# EAGLE design shifter (EAGLE 6.4)
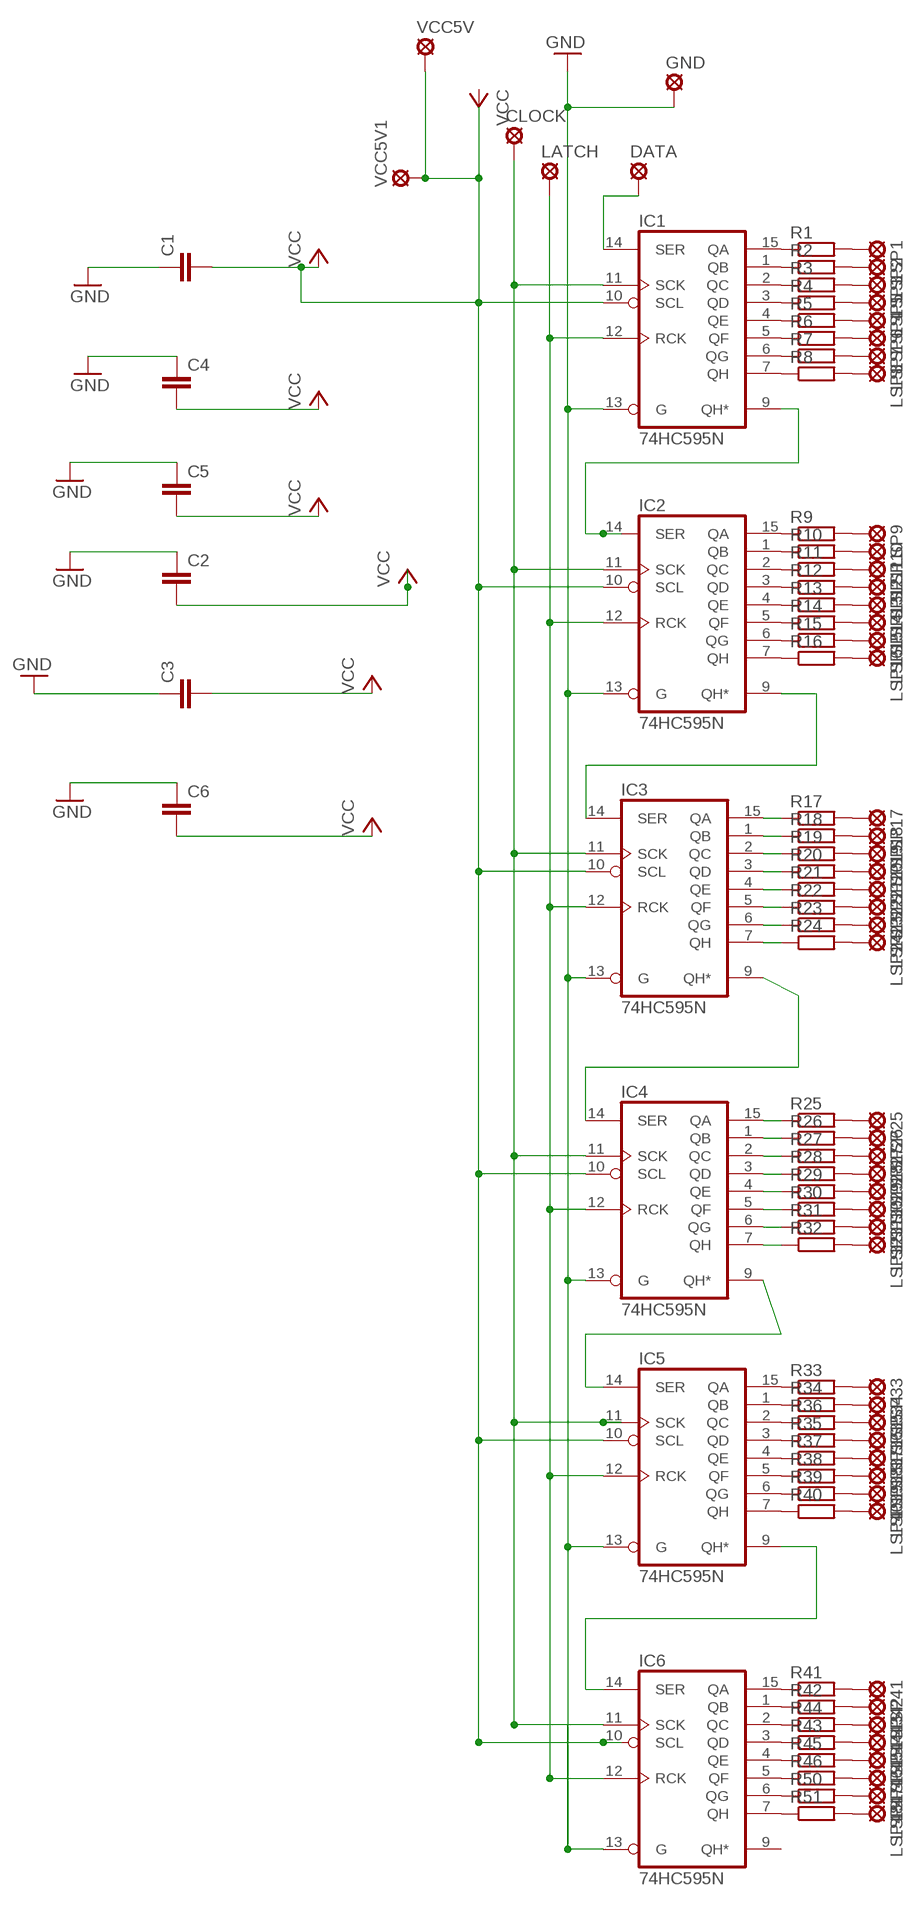
[diagram p0: schematic, sheet 1]

## Parts
C1  C-EU025-025X050  [C025-025X050]
C2  C-EU025-025X050  [C025-025X050]
C3  C-EU025-025X050  [C025-025X050]
C4  C-EU025-025X050  [C025-025X050]
C5  C-EU025-025X050  [C025-025X050]
C6  C-EU025-025X050  [C025-025X050]
CLOCK  LSP10  [LSP10]
DATA  LSP10  [LSP10]
GND  LSP10  [LSP10]
IC1  74HC595N  [DIL16]
IC2  74HC595N  [DIL16]
IC3  74HC595N  [DIL16]
IC4  74HC595N  [DIL16]
IC5  74HC595N  [DIL16]
IC6  74HC595N  [DIL16]
LATCH  LSP10  [LSP10]
LSP1  LSP10  [LSP10]
LSP2  LSP10  [LSP10]
LSP3  LSP10  [LSP10]
LSP4  LSP10  [LSP10]
LSP5  LSP10  [LSP10]
LSP6  LSP10  [LSP10]
LSP7  LSP10  [LSP10]
LSP8  LSP10  [LSP10]
LSP9  LSP10  [LSP10]
LSP10  LSP10  [LSP10]
LSP11  LSP10  [LSP10]
LSP12  LSP10  [LSP10]
LSP13  LSP10  [LSP10]
LSP14  LSP10  [LSP10]
LSP15  LSP10  [LSP10]
LSP16  LSP10  [LSP10]
LSP17  LSP10  [LSP10]
LSP18  LSP10  [LSP10]
LSP19  LSP10  [LSP10]
LSP20  LSP10  [LSP10]
LSP21  LSP10  [LSP10]
LSP22  LSP10  [LSP10]
LSP23  LSP10  [LSP10]
LSP24  LSP10  [LSP10]
LSP25  LSP10  [LSP10]
LSP26  LSP10  [LSP10]
LSP27  LSP10  [LSP10]
LSP28  LSP10  [LSP10]
LSP29  LSP10  [LSP10]
LSP30  LSP10  [LSP10]
LSP31  LSP10  [LSP10]
LSP32  LSP10  [LSP10]
LSP33  LSP10  [LSP10]
LSP34  LSP10  [LSP10]
LSP35  LSP10  [LSP10]
LSP36  LSP10  [LSP10]
LSP37  LSP10  [LSP10]
LSP38  LSP10  [LSP10]
LSP39  LSP10  [LSP10]
LSP40  LSP10  [LSP10]
LSP41  LSP10  [LSP10]
LSP42  LSP10  [LSP10]
LSP43  LSP10  [LSP10]
LSP44  LSP10  [LSP10]
LSP45  LSP10  [LSP10]
LSP46  LSP10  [LSP10]
LSP47  LSP10  [LSP10]
LSP48  LSP10  [LSP10]
R1  R-EU_0204/2V  [0204V]
R2  R-EU_0204/2V  [0204V]
R3  R-EU_0204/2V  [0204V]
R4  R-EU_0204/2V  [0204V]
R5  R-EU_0204/2V  [0204V]
R6  R-EU_0204/2V  [0204V]
R7  R-EU_0204/2V  [0204V]
R8  R-EU_0204/2V  [0204V]
R9  R-EU_0204/2V  [0204V]
R10  R-EU_0204/2V  [0204V]
R11  R-EU_0204/2V  [0204V]
R12  R-EU_0204/2V  [0204V]
R13  R-EU_0204/2V  [0204V]
R14  R-EU_0204/2V  [0204V]
R15  R-EU_0204/2V  [0204V]
R16  R-EU_0204/2V  [0204V]
R17  R-EU_0204/2V  [0204V]
R18  R-EU_0204/2V  [0204V]
R19  R-EU_0204/2V  [0204V]
R20  R-EU_0204/2V  [0204V]
R21  R-EU_0204/2V  [0204V]
R22  R-EU_0204/2V  [0204V]
R23  R-EU_0204/2V  [0204V]
R24  R-EU_0204/2V  [0204V]
R25  R-EU_0204/2V  [0204V]
R26  R-EU_0204/2V  [0204V]
R27  R-EU_0204/2V  [0204V]
R28  R-EU_0204/2V  [0204V]
R29  R-EU_0204/2V  [0204V]
R30  R-EU_0204/2V  [0204V]
R31  R-EU_0204/2V  [0204V]
R32  R-EU_0204/2V  [0204V]
R33  R-EU_0204/2V  [0204V]
R34  R-EU_0204/2V  [0204V]
R35  R-EU_0204/2V  [0204V]
R36  R-EU_0204/2V  [0204V]
R37  R-EU_0204/2V  [0204V]
R38  R-EU_0204/2V  [0204V]
R39  R-EU_0204/2V  [0204V]
R40  R-EU_0204/2V  [0204V]
R41  R-EU_0204/2V  [0204V]
R42  R-EU_0204/2V  [0204V]
R43  R-EU_0204/2V  [0204V]
R44  R-EU_0204/2V  [0204V]
R45  R-EU_0204/2V  [0204V]
R46  R-EU_0204/2V  [0204V]
R50  R-EU_0204/2V  [0204V]
R51  R-EU_0204/2V  [0204V]
VCC5V  LSP10  [LSP10]
VCC5V1  LSP10  [LSP10]

## Nets
N$1: IC6.2(QC) R44.1
N$2: IC6.3(QD) R43.1
N$3: LSP1.MP R1.2
N$4: IC1.9(QH*) IC2.14(SER)
N$5: IC2.9(QH*) IC3.14(SER)
N$6: LSP17.MP R17.2
N$7: IC4.9(QH*) IC5.14(SER)
N$8: LSP25.MP R25.2
N$9: C1.1 C2.1 C3.1 C4.1 C5.1 C6.1 GND.MP IC1.13(G) IC2.13(G) IC3.13(G) IC4.13(G) IC5.13(G) IC6.13(G) ; supply symbol labelled GND
N$10: IC1.15(QA) R1.1
N$11: LSP41.MP R41.2
N$12: IC1.1(QB) R2.1
N$13: IC1.2(QC) R3.1
N$14: IC1.3(QD) R4.1
N$15: IC1.4(QE) R5.1
N$16: IC1.5(QF) R6.1
N$17: IC1.6(QG) R7.1
N$18: IC1.7(QH) R8.1
N$19: IC2.15(QA) R9.1
N$20: IC2.1(QB) R10.1
N$21: IC2.2(QC) R11.1
N$22: IC2.3(QD) R12.1
N$23: IC2.4(QE) R13.1
N$24: IC2.5(QF) R14.1
N$25: IC2.6(QG) R15.1
N$26: IC2.7(QH) R16.1
N$27: IC3.15(QA) R17.1
N$28: IC3.1(QB) R18.1
N$29: IC3.2(QC) R19.1
N$30: IC3.3(QD) R20.1
N$31: IC3.4(QE) R21.1
N$32: IC3.5(QF) R22.1
N$33: IC3.6(QG) R23.1
N$34: IC3.7(QH) R24.1
N$35: IC4.15(QA) R25.1
N$36: IC4.1(QB) R26.1
N$37: IC4.2(QC) R27.1
N$38: IC4.3(QD) R28.1
N$39: IC4.4(QE) R29.1
N$40: IC4.5(QF) R30.1
N$41: IC4.6(QG) R31.1
N$42: IC4.7(QH) R32.1
N$43: IC5.15(QA) R33.1
N$44: IC5.1(QB) R34.1
N$45: IC5.2(QC) R36.1
N$46: IC5.3(QD) R35.1
N$47: IC5.4(QE) R37.1
N$48: IC5.5(QF) R38.1
N$49: IC5.6(QG) R39.1
N$50: IC5.7(QH) R40.1
N$51: IC6.15(QA) R41.1
N$52: IC6.1(QB) R42.1
N$53: IC6.4(QE) R45.1
N$54: IC6.5(QF) R46.1
N$55: IC6.6(QG) R50.1
N$56: IC6.7(QH) R51.1
N$57: LSP2.MP R2.2
N$58: LSP3.MP R3.2
N$59: LSP4.MP R5.2
N$60: LSP5.MP R4.2
N$61: LSP6.MP R6.2
N$62: LSP7.MP R7.2
N$63: LSP8.MP R8.2
N$64: LSP9.MP R9.2
N$65: LSP10.MP R10.2
N$66: LSP12.MP R12.2
N$67: LSP13.MP R13.2
N$68: LSP14.MP R14.2
N$69: LSP15.MP R15.2
N$70: LSP11.MP R11.2
N$71: LSP16.MP R16.2
N$72: LSP18.MP R18.2
N$73: LSP19.MP R19.2
N$74: LSP20.MP R20.2
N$75: LSP21.MP R21.2
N$76: LSP23.MP R23.2
N$77: LSP24.MP R24.2
N$78: LSP22.MP R22.2
N$79: LSP26.MP R26.2
N$80: LSP27.MP R27.2
N$81: LSP28.MP R28.2
N$82: LSP29.MP R29.2
N$83: LSP30.MP R30.2
N$84: LSP31.MP R31.2
N$85: LSP32.MP R32.2
N$86: LSP33.MP R33.2
N$87: LSP34.MP R34.2
N$88: LSP35.MP R36.2
N$89: LSP36.MP R35.2
N$90: LSP37.MP R37.2
N$91: LSP38.MP R38.2
N$92: LSP39.MP R39.2
N$93: LSP40.MP R40.2
N$94: LSP42.MP R42.2
N$95: LSP44.MP R43.2
N$96: LSP46.MP R46.2
N$97: LSP47.MP R50.2
N$98: LSP48.MP R51.2
N$99: LSP43.MP R44.2
N$100: LSP45.MP R45.2
N$101: IC3.9(QH*) IC4.14(SER)
N$102: CLOCK.MP IC1.11(SCK) IC2.11(SCK) IC3.11(SCK) IC4.11(SCK) IC5.11(SCK) IC6.11(SCK)
N$103: DATA.MP IC1.14(SER)
N$110: IC1.12(RCK) IC2.12(RCK) IC3.12(RCK) IC4.12(RCK) IC5.12(RCK) IC6.12(RCK) LATCH.MP
N$129: IC5.9(QH*) IC6.14(SER)
VCC: C1.2 C2.2 C3.2 C4.2 C5.2 C6.2 IC1.10(SCL) IC2.10(SCL) IC3.10(SCL) IC4.10(SCL) IC5.10(SCL) IC6.10(SCL) VCC5V1.MP VCC5V.MP
Unconnected: IC6.9(QH*)

## Power pins joined to a net without a drawn wire
N$9: IC1.8(GND) IC2.8(GND) IC3.8(GND) IC4.8(GND) IC5.8(GND) IC6.8(GND)
VCC: IC1.16(VCC) IC2.16(VCC) IC3.16(VCC) IC4.16(VCC) IC5.16(VCC) IC6.16(VCC)

## Library data of the parts
C1-C6 = resistor:C-EU: CAPACITOR, European symbol
CLOCK DATA GND LATCH LSP1-LSP48 VCC5V VCC5V1 = solpad:LSP10: SOLDER PAD drill 1.0 mm, distributor Buerklin, 12H555
IC1-IC6 = 74xx-eu:74*595: 8-bit SHIFT REGISTER, output latch
R1-R46 R50 R51 = rcl:R-EU_: RESISTOR, European symbol

## Board
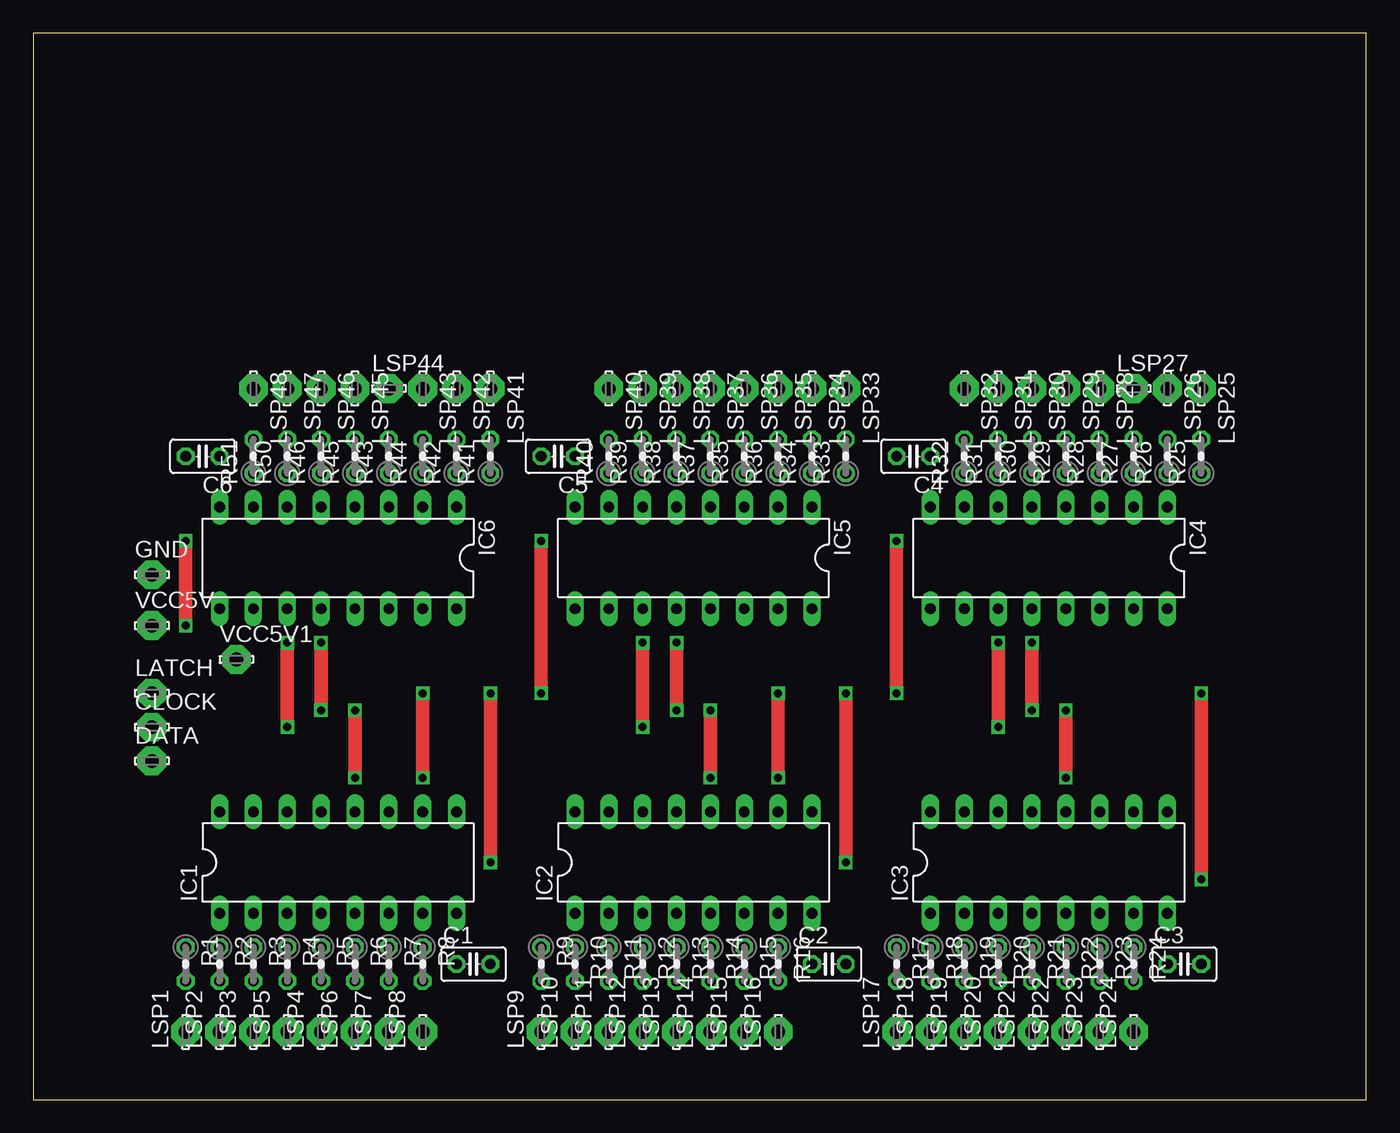
[diagram p1: board, top side]
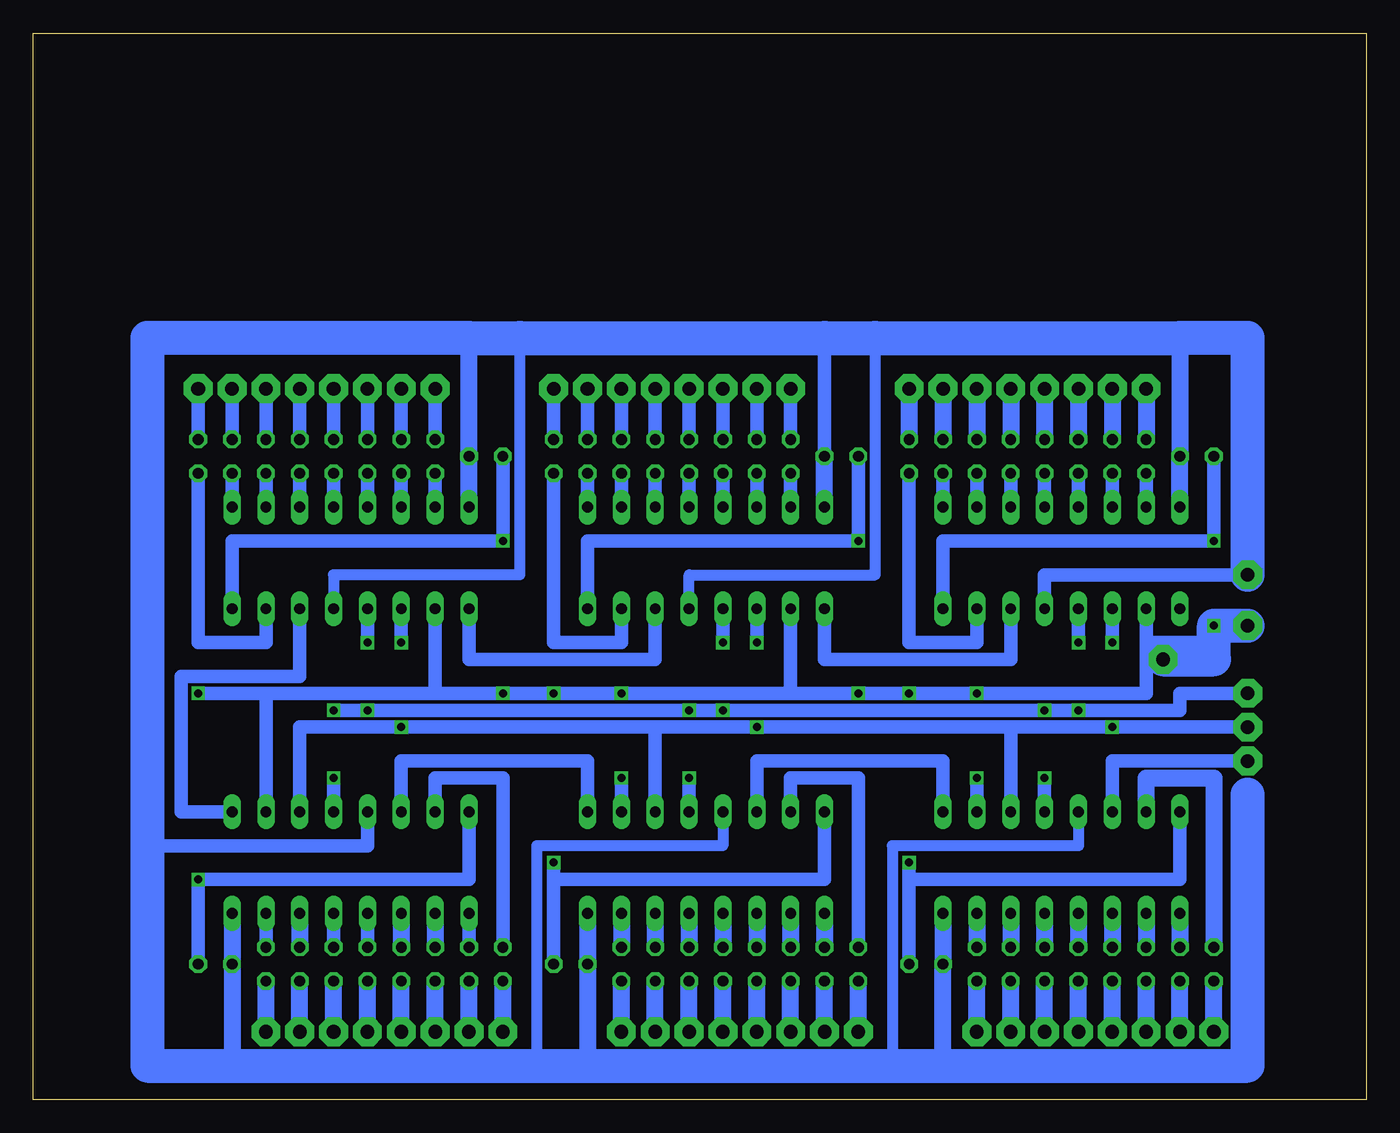
[diagram p2: board, bottom side, seen from below]

Size 100 x 80 mm. Coordinates in mm from the lower left corner, seen from the top.
Outline: 0,0 100,0 100,80 0,80 0,0
Copper layers (1*16): Top 0.035mm / dielectric 1.5mm / Bottom 0.035mm
Design rules "default": minimum track width 10mil, minimum drill 24mil, track to track 8mil, track to pad 8mil, pad to pad 8mil, via to via 8mil, smd to smd 8mil, copper to edge 40mil, drill to drill 8mil, minimum pad ring 10mil, minimum via ring 8mil, stop-mask expansion 4mil, vias tented up to drill 0mil, thermal gap 10mil

### Footprints (pad centres in the part's own frame; a part is rotated, then mirrored left to right if it is on the bottom)
C025-025X050 = drill 0.813 octagon: 1 -1.27,0; 2 1.27,0
LSP10 = drill 1.016 pad 2.159 octagon: MP 0,0
DIL16 = drill 0.813 long: 1 -8.89,-3.81; 2 -6.35,-3.81; 3 -3.81,-3.81; 4 -1.27,-3.81; 5 1.27,-3.81; 6 3.81,-3.81; 7 6.35,-3.81; 8 8.89,-3.81; 9 8.89,3.81; 10 6.35,3.81; 11 3.81,3.81; 12 1.27,3.81; 13 -1.27,3.81; 14 -3.81,3.81; 15 -6.35,3.81; 16 -8.89,3.81
0204V = drill 0.813 octagon: 1 -1.27,0; 2 1.27,0

### Placement (x,y rotation side)
C1  33.02,10.16 0 top
C2  59.69,10.16 0 top
C3  86.36,10.16 0 top
C4  66.04,48.26 180 top
C5  39.37,48.26 180 top
C6  12.7,48.26 180 top
CLOCK  8.89,27.94 0 top
DATA  8.89,25.4 0 top
GND  8.89,39.37 0 top
IC1  22.86,17.78 0 top
IC2  49.53,17.78 0 top
IC3  76.2,17.78 0 top
IC4  76.2,40.64 180 top
IC5  49.53,40.64 180 top
IC6  22.86,40.64 180 top
LATCH  8.89,30.48 0 top
LSP1  11.43,5.08 90 top
LSP2  13.97,5.08 90 top
LSP3  16.51,5.08 90 top
LSP4  21.59,5.08 90 top
LSP5  19.05,5.08 90 top
LSP6  24.13,5.08 90 top
LSP7  26.67,5.08 90 top
LSP8  29.21,5.08 90 top
LSP9  38.1,5.08 90 top
LSP10  40.64,5.08 90 top
LSP11  43.18,5.08 90 top
LSP12  45.72,5.08 90 top
LSP13  48.26,5.08 90 top
LSP14  50.8,5.08 90 top
LSP15  53.34,5.08 90 top
LSP16  55.88,5.08 90 top
LSP17  64.77,5.08 90 top
LSP18  67.31,5.08 90 top
LSP19  69.85,5.08 90 top
LSP20  72.39,5.08 90 top
LSP21  74.93,5.08 90 top
LSP22  77.47,5.08 90 top
LSP23  80.01,5.08 90 top
LSP24  82.55,5.08 90 top
LSP25  87.63,53.34 270 top
LSP26  85.09,53.34 270 top
LSP27  82.55,53.34 0 top
LSP28  80.01,53.34 270 top
LSP29  77.47,53.34 270 top
LSP30  74.93,53.34 270 top
LSP31  72.39,53.34 270 top
LSP32  69.85,53.34 270 top
LSP33  60.96,53.34 270 top
LSP34  58.42,53.34 270 top
LSP35  55.88,53.34 270 top
LSP36  53.34,53.34 270 top
LSP37  50.8,53.34 270 top
LSP38  48.26,53.34 270 top
LSP39  45.72,53.34 270 top
LSP40  43.18,53.34 270 top
LSP41  34.29,53.34 270 top
LSP42  31.75,53.34 270 top
LSP43  29.21,53.34 270 top
LSP44  26.67,53.34 0 top
LSP45  24.13,53.34 270 top
LSP46  21.59,53.34 270 top
LSP47  19.05,53.34 270 top
LSP48  16.51,53.34 270 top
R1  11.43,10.16 270 top
R2  13.97,10.16 270 top
R3  16.51,10.16 270 top
R4  19.05,10.16 270 top
R5  21.59,10.16 270 top
R6  24.13,10.16 270 top
R7  26.67,10.16 270 top
R8  29.21,10.16 270 top
R9  38.1,10.16 270 top
R10  40.64,10.16 270 top
R11  43.18,10.16 270 top
R12  45.72,10.16 270 top
R13  48.26,10.16 270 top
R14  50.8,10.16 270 top
R15  53.34,10.16 270 top
R16  55.88,10.16 270 top
R17  64.77,10.16 270 top
R18  67.31,10.16 270 top
R19  69.85,10.16 270 top
R20  72.39,10.16 270 top
R21  74.93,10.16 270 top
R22  77.47,10.16 270 top
R23  80.01,10.16 270 top
R24  82.55,10.16 270 top
R25  87.63,48.26 90 top
R26  85.09,48.26 90 top
R27  82.55,48.26 90 top
R28  80.01,48.26 90 top
R29  77.47,48.26 90 top
R30  74.93,48.26 90 top
R31  72.39,48.26 90 top
R32  69.85,48.26 90 top
R33  60.96,48.26 90 top
R34  58.42,48.26 90 top
R35  53.34,48.26 90 top
R36  55.88,48.26 90 top
R37  50.8,48.26 90 top
R38  48.26,48.26 90 top
R39  45.72,48.26 90 top
R40  43.18,48.26 90 top
R41  34.29,48.26 90 top
R42  31.75,48.26 90 top
R43  26.67,48.26 90 top
R44  29.21,48.26 90 top
R45  24.13,48.26 90 top
R46  21.59,48.26 90 top
R50  19.05,48.26 90 top
R51  16.51,48.26 90 top
VCC5V  8.89,35.56 0 top
VCC5V1  15.24,33.02 0 top

### Tracks (layer width: path | path; a pad name or v marks a point on that pad's centre or on a via)
N$1
  Bottom 1.016: R44.1 IC6.2
N$2
  Bottom 1.016: R43.1 IC6.3
N$3
  Bottom 1.27: LSP1.MP R1.2
N$4
  Bottom 1.016: IC1.9 31.75,25.4 45.72,25.4 IC2.14
N$5
  Bottom 1.016: IC2.9 58.42,25.4 72.39,25.4 IC3.14
N$6
  Bottom 1.27: LSP17.MP R17.2
N$7
  Bottom 1.016: IC5.14 53.34,33.02 67.31,33.02 IC4.9
N$8
  Bottom 1.016: LSP25.MP R25.2
N$9
  Bottom 0.813: IC1.13 21.59,19.05 35.56,19.05 35.56,2.54 | IC2.13 48.26,19.05 62.23,19.05 62.23,2.54 | IC4.13 77.47,39.37 63.5,39.37 63.5,57.15 | IC5.13 50.8,39.37 36.83,39.37 36.83,57.15
  Bottom 1.016: IC3.13 74.93,19.05 91.44,19.05 | IC4.8 C4.1 | 40.64,57.15 C5.1 | IC6.13 24.13,39.37 GND.MP
  Bottom 1.27: IC6.8 C6.1 13.97,57.15 | IC1.8 C1.1 31.75,2.54 | IC2.8 C2.1 58.42,2.54 | IC3.8 C3.1 85.09,2.54 | IC4.8 67.31,57.15 | IC5.8 C5.1
  Bottom 2.54: 8.89,22.86 8.89,2.54 31.75,2.54 35.56,2.54 58.42,2.54 62.23,2.54 85.09,2.54 91.44,2.54 91.44,19.05 91.44,57.15 67.31,57.15 63.5,57.15 40.64,57.15 36.83,57.15 13.97,57.15 8.89,57.15 GND.MP
N$10
  Bottom 1.27: IC1.15 16.51,24.13 11.43,24.13 R1.1
N$11
  Bottom 1.27: LSP41.MP R41.2
N$12
  Bottom 1.27: IC1.1 R2.1
N$13
  Bottom 1.27: IC1.2 R3.1
N$14
  Bottom 1.27: IC1.3 R4.1
N$15
  Bottom 1.27: IC1.4 R5.1
N$16
  Bottom 1.27: IC1.5 R6.1
N$17
  Bottom 1.27: IC1.6 R7.1
N$18
  Bottom 1.27: IC1.7 R8.1
N$19
  Bottom 1.016: IC2.15 43.18,24.13 38.1,24.13 R9.1
N$20
  Bottom 1.27: IC2.1 R10.1
N$21
  Bottom 1.27: IC2.2 R11.1
N$22
  Bottom 1.27: IC2.3 R12.1
N$23
  Bottom 1.27: IC2.4 R13.1
N$24
  Bottom 1.27: IC2.5 R14.1
N$25
  Bottom 1.27: IC2.6 R15.1
N$26
  Bottom 1.27: IC2.7 R16.1
N$27
  Bottom 1.016: IC3.15 69.85,24.13 64.77,24.13 R17.1
N$28
  Bottom 1.016: IC3.1 R18.1
N$29
  Bottom 1.27: IC3.2 R19.1
N$30
  Bottom 1.27: IC3.3 R20.1
N$31
  Bottom 1.016: IC3.4 R21.1
N$32
  Bottom 1.016: IC3.5 R22.1
N$33
  Bottom 1.27: IC3.6 R23.1
N$34
  Bottom 1.016: IC3.7 R24.1
N$35
  Bottom 1.016: IC4.15 82.55,34.29 87.63,34.29 R25.1
N$36
  Bottom 1.016: R26.1 IC4.1
N$37
  Bottom 1.016: R27.1 IC4.2
N$38
  Bottom 1.016: R28.1 IC4.3
N$39
  Bottom 1.016: R29.1 IC4.4
N$40
  Bottom 1.016: IC4.5 R30.1
N$41
  Bottom 1.016: R31.1 IC4.6
N$42
  Bottom 1.016: R32.1 IC4.7
N$43
  Bottom 1.016: IC5.15 55.88,34.29 60.96,34.29 R33.1
N$44
  Bottom 1.016: R34.1 IC5.1
N$45
  Bottom 1.016: R36.1 IC5.2
N$46
  Bottom 1.016: R35.1 IC5.3
N$47
  Bottom 1.016: R37.1 IC5.4
N$48
  Bottom 1.016: R38.1 IC5.5
N$49
  Bottom 1.016: R39.1 IC5.6
N$50
  Bottom 1.016: R40.1 IC5.7
N$51
  Bottom 1.016: IC6.15 29.21,34.29 34.29,34.29 R41.1
N$52
  Bottom 1.016: R42.1 IC6.1
N$53
  Bottom 1.016: R45.1 IC6.4
N$54
  Bottom 1.016: R46.1 IC6.5
N$55
  Bottom 1.016: R50.1 IC6.6
N$56
  Bottom 1.016: R51.1 IC6.7
N$57
  Bottom 1.27: LSP2.MP R2.2
N$58
  Bottom 1.27: LSP3.MP R3.2
N$59
  Bottom 1.27: LSP4.MP R5.2
N$60
  Bottom 1.27: LSP5.MP R4.2
N$61
  Bottom 1.27: LSP6.MP R6.2
N$62
  Bottom 1.27: LSP7.MP R7.2
N$63
  Bottom 1.27: LSP8.MP R8.2
N$64
  Bottom 1.27: LSP9.MP R9.2
N$65
  Bottom 1.27: LSP10.MP R10.2
N$66
  Bottom 1.27: LSP12.MP R12.2
N$67
  Bottom 1.27: LSP13.MP R13.2
N$68
  Bottom 1.27: LSP14.MP R14.2
N$69
  Bottom 1.27: LSP15.MP R15.2
N$70
  Bottom 1.27: LSP11.MP R11.2
N$71
  Bottom 1.27: LSP16.MP R16.2
N$72
  Bottom 1.27: LSP18.MP R18.2
N$73
  Bottom 1.27: LSP19.MP R19.2
N$74
  Bottom 1.27: LSP20.MP R20.2
N$75
  Bottom 1.27: LSP21.MP R21.2
N$76
  Bottom 1.27: LSP23.MP R23.2
N$77
  Bottom 1.27: LSP24.MP R24.2
N$78
  Bottom 1.27: LSP22.MP R22.2
N$79
  Bottom 1.016: LSP26.MP R26.2
N$80
  Bottom 1.016: LSP27.MP R27.2
N$81
  Bottom 1.016: LSP28.MP R28.2
N$82
  Bottom 1.016: LSP29.MP R29.2
N$83
  Bottom 1.016: LSP30.MP R30.2
N$84
  Bottom 1.016: LSP31.MP R31.2
N$85
  Bottom 1.016: LSP32.MP R32.2
N$86
  Bottom 1.016: LSP33.MP R33.2
N$87
  Bottom 1.016: LSP34.MP R34.2
N$88
  Bottom 1.016: LSP35.MP R36.2
N$89
  Bottom 1.016: LSP36.MP R35.2
N$90
  Bottom 1.016: LSP37.MP R37.2
N$91
  Bottom 1.016: LSP38.MP R38.2
N$92
  Bottom 1.016: LSP39.MP R39.2
N$93
  Bottom 1.016: LSP40.MP R40.2
N$94
  Bottom 1.27: LSP42.MP R42.2
N$95
  Bottom 1.27: LSP44.MP R43.2
N$96
  Bottom 1.27: LSP46.MP R46.2
N$97
  Bottom 1.27: LSP47.MP R50.2
N$98
  Bottom 1.27: LSP48.MP R51.2
N$99
  Bottom 1.27: LSP43.MP R44.2
N$100
  Bottom 1.27: LSP45.MP R45.2
N$101
  Bottom 1.016: IC4.14 80.01,31.75 88.9,31.75 88.9,21.59 IC3.9
N$102  (via drill 0.6)
  Top 1.016: v45.72,34.29 v45.72,27.94 | v72.39,34.29 v72.39,27.94 | v19.05,34.29 v19.05,27.94
  Bottom 1.016: 26.67,27.94 v19.05,27.94 CLOCK.MP | 26.67,27.94 v45.72,27.94 53.34,27.94 | 53.34,27.94 v72.39,27.94 80.01,27.94 IC3.11 | IC2.11 53.34,27.94 | IC5.11 v45.72,34.29 | IC4.11 v72.39,34.29 | IC1.11 26.67,27.94 | IC6.11 v19.05,34.29
N$103
  Bottom 1.016: IC1.14 19.05,25.4 DATA.MP
N$110  (via drill 0.6)
  Top 1.016: v77.47,29.21 v77.47,24.13 | v74.93,34.29 v74.93,29.21 | v50.8,24.13 v50.8,29.21 | v48.26,34.29 v48.26,29.21 | v24.13,24.13 v24.13,29.21 | v21.59,34.29 v21.59,29.21
  Bottom 1.016: v77.47,29.21 v74.93,29.21 v50.8,29.21 v48.26,29.21 v24.13,29.21 v21.59,29.21 13.97,29.21 13.97,30.48 LATCH.MP | v77.47,24.13 IC3.12 | IC4.12 v74.93,34.29 | IC2.12 v50.8,24.13 | IC5.12 v48.26,34.29 | IC1.12 v24.13,24.13 | IC6.12 v21.59,34.29
N$129
  Bottom 1.016: IC5.9 40.64,33.02 26.67,33.02 IC6.14
VCC  (via drill 0.6)
  Top 1.016: v11.43,41.91 v11.43,35.56 | v29.21,24.13 v29.21,30.48 | v55.88,24.13 v55.88,30.48 | v87.63,16.51 v87.63,30.48 | v64.77,41.91 v64.77,30.48 | v38.1,41.91 v38.1,30.48 | v60.96,17.78 v60.96,30.48 | v34.29,17.78 v34.29,30.48
  Bottom 1.016: 43.18,30.48 v38.1,30.48 v34.29,30.48 v29.21,30.48 16.51,30.48 16.51,34.29 | 43.18,30.48 v55.88,30.48 v60.96,30.48 v64.77,30.48 69.85,30.48 | 69.85,30.48 82.55,30.48 | 82.55,30.48 IC3.10 | IC4.10 69.85,30.48 | IC5.10 43.18,30.48 | IC6.10 16.51,34.29 | IC1.16 13.97,16.51 34.29,16.51 | 34.29,16.51 C1.2 | IC2.16 40.64,16.51 60.96,16.51 | 60.96,16.51 C2.2 | IC3.16 67.31,16.51 v87.63,16.51 C3.2 | C4.2 v64.77,41.91 85.09,41.91 IC4.16 | IC5.16 58.42,41.91 v38.1,41.91 C5.2 | IC6.16 31.75,41.91 v11.43,41.91 C6.2 | IC1.10 v29.21,24.13 | IC2.10 v55.88,24.13 | v87.63,30.48 82.55,30.48 | 60.96,16.51 v60.96,17.78 | 34.29,16.51 v34.29,17.78 | v11.43,35.56 11.43,34.29 16.51,34.29
  Bottom 2.54: VCC5V1.MP 11.43,33.02 v11.43,35.56 VCC5V.MP